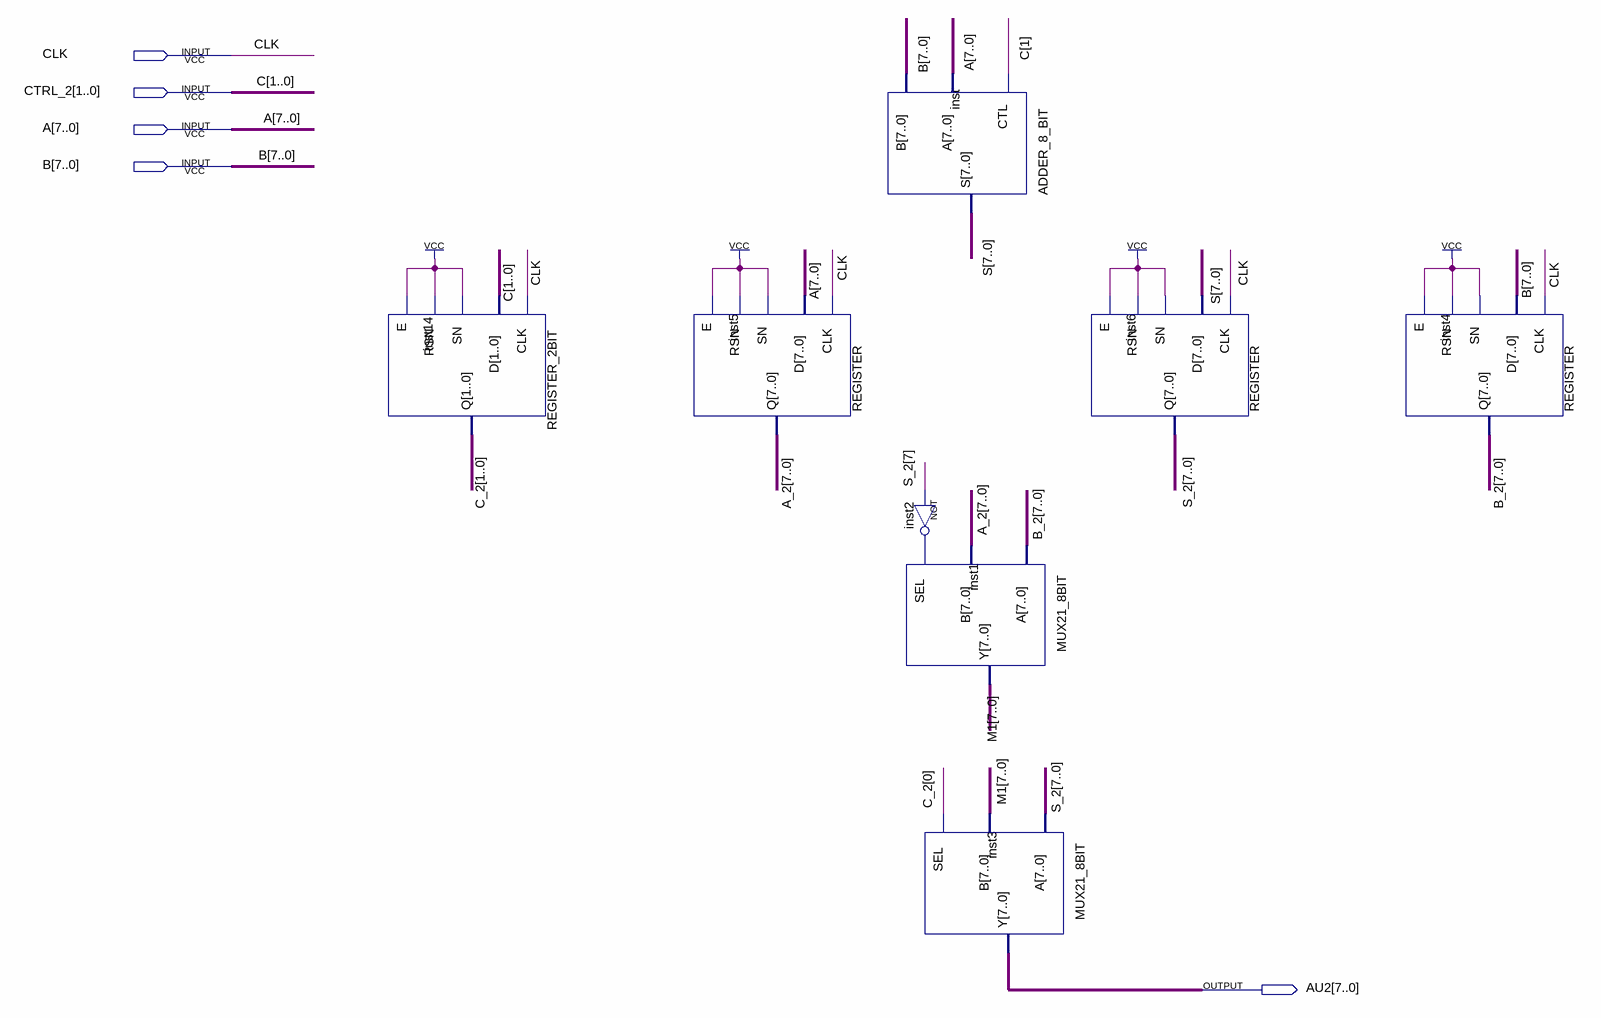
[diagram p0: schematic sheet]
// Quartus schematic AU2.bdf as structural Verilog: 8 symbols, 5 pins
module AU2 (
  input  CLK,
  input  [1:0] CTRL_2,
  input  [7:0] A,
  input  [7:0] B,
  output [7:0] AU2
);

  wire inst2_out;
  wire [1:0] C_2;
  wire [7:0] A_2, B_2, M1, S, S_2;

  REGISTER_2BIT inst14 (.CLK(CLK), .D(CTRL_2), .SN(1'b1), .RSN(1'b1), .E(1'b1), .Q(C_2));
  REGISTER inst5 (.CLK(CLK), .D(A), .SN(1'b1), .RSN(1'b1), .E(1'b1), .Q(A_2));
  ADDER_8_BIT inst (.CTL(CTRL_2[1]), .A(A), .B(B), .S(S));
  not inst2 (inst2_out, S_2[7]);
  MUX21_8BIT inst1 (.A(B_2), .B(A_2), .SEL(inst2_out), .Y(M1));
  MUX21_8BIT inst3 (.A(S_2), .B(M1), .SEL(C_2[0]), .Y(AU2));
  REGISTER inst6 (.CLK(CLK), .D(S), .SN(1'b1), .RSN(1'b1), .E(1'b1), .Q(S_2));
  REGISTER inst4 (.CLK(CLK), .D(B), .SN(1'b1), .RSN(1'b1), .E(1'b1), .Q(B_2));

  // Other names for the same wires on the sheet: C[1:0] = CTRL_2
endmodule
